# EAGLE design Nixie_clock (EAGLE 7.4.0)
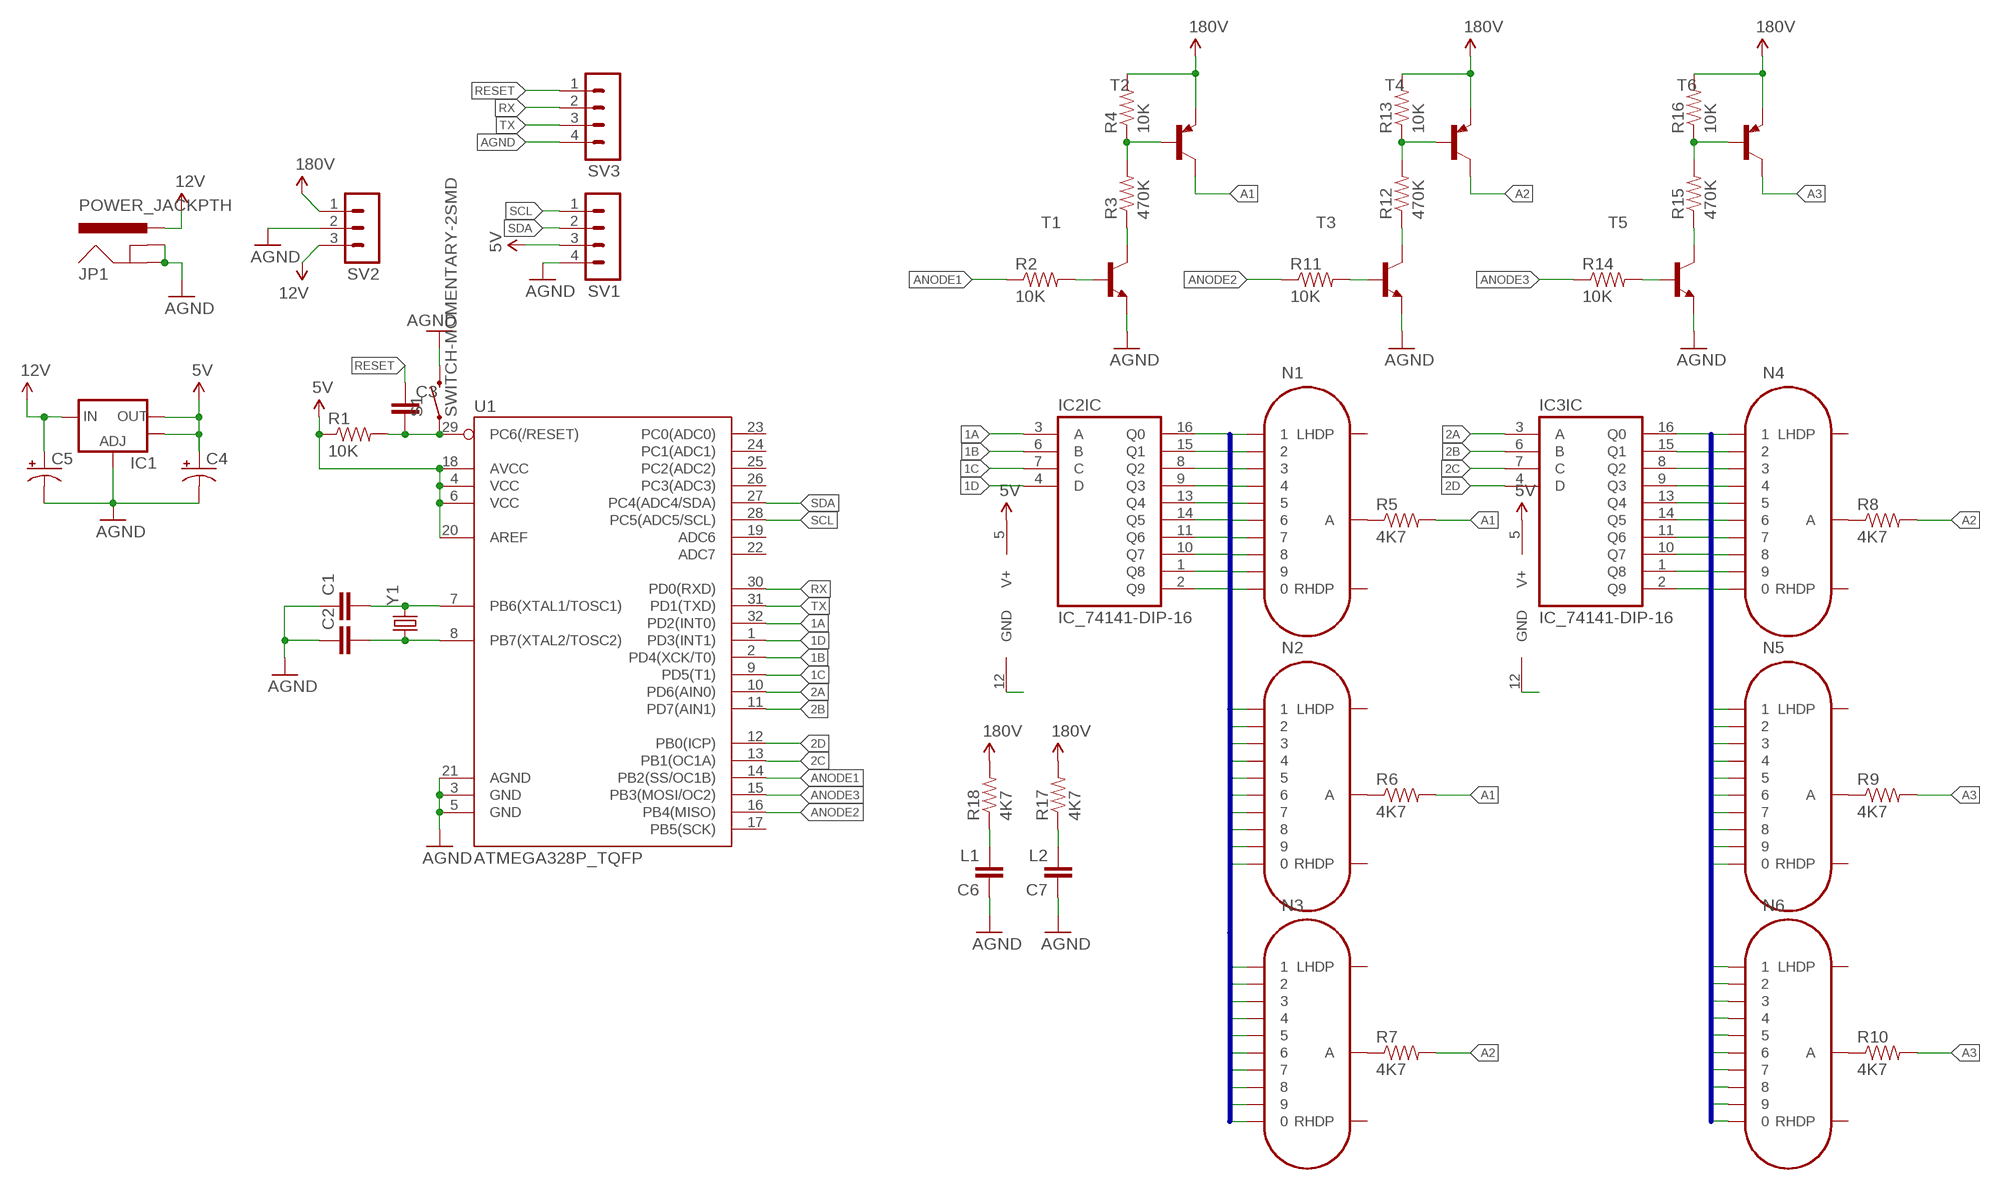
[diagram p0: schematic, sheet 1]

## Parts
C1  CAPPTH  [CAP-PTH-SMALL]
C2  CAPPTH  [CAP-PTH-SMALL]
C3  CAPPTH  [CAP-PTH-SMALL]
C4  10UF-25V-20%(PTH)  [CPOL-RADIAL-10UF-25V]
C5  10UF-25V-20%(PTH)  [CPOL-RADIAL-10UF-25V]
C6  L1  CAPPTH  [CAP-PTH-SMALL]
C7  L2  CAPPTH  [CAP-PTH-SMALL]
IC1  V_REG_LM1117SOT223  [SOT223]
IC2  IC_74141-DIP-16  [DIL16]
IC3  IC_74141-DIP-16  [DIL16]
JP1  POWER_JACKPTH  [POWER_JACK_PTH]
N1  IN-14  [IN-14]
N2  IN-14  [IN-14]
N3  IN-14  [IN-14]
N4  IN-14  [IN-14]
N5  IN-14  [IN-14]
N6  IN-14  [IN-14]
R1  10K  10KOHM-1/10W-1%(0603)0603  [0603-RES]
R2  10K  10KOHM-1/10W-1%(0603)0603  [0603-RES]
R3  470K  1KOHM-1/4W-1%(PTH)  [AXIAL-0.3]
R4  10K  1KOHM-1/4W-1%(PTH)  [AXIAL-0.3]
R5  4K7  1KOHM-1/4W-1%(PTH)  [AXIAL-0.3]
R6  4K7  1KOHM-1/4W-1%(PTH)  [AXIAL-0.3]
R7  4K7  1KOHM-1/4W-1%(PTH)  [AXIAL-0.3]
R8  4K7  1KOHM-1/4W-1%(PTH)  [AXIAL-0.3]
R9  4K7  1KOHM-1/4W-1%(PTH)  [AXIAL-0.3]
R10  4K7  1KOHM-1/4W-1%(PTH)  [AXIAL-0.3]
R11  10K  10KOHM-1/10W-1%(0603)0603  [0603-RES]
R12  470K  1KOHM-1/4W-1%(PTH)  [AXIAL-0.3]
R13  10K  1KOHM-1/4W-1%(PTH)  [AXIAL-0.3]
R14  10K  10KOHM-1/10W-1%(0603)0603  [0603-RES]
R15  470K  1KOHM-1/4W-1%(PTH)  [AXIAL-0.3]
R16  10K  1KOHM-1/4W-1%(PTH)  [AXIAL-0.3]
R17  4K7  1KOHM-1/4W-1%(PTH)  [AXIAL-0.3]
R18  4K7  1KOHM-1/4W-1%(PTH)  [AXIAL-0.3]
S1  SWITCH-MOMENTARY-2SMD  [TACTILE-SWITCH-SMD]
SV1  MA04-1  [MA04-1]
SV2  MA03-1  [MA03-1]
SV3  MA04-1  [MA04-1]
T1  MPSA42-NPN-TO92-EBC  [TO92-EBC]
T2  MPSA92-PNP-TO92-EBC  [TO92-EBC]
T3  MPSA42-NPN-TO92-EBC  [TO92-EBC]
T4  MPSA92-PNP-TO92-EBC  [TO92-EBC]
T5  MPSA42-NPN-TO92-EBC  [TO92-EBC]
T6  MPSA92-PNP-TO92-EBC  [TO92-EBC]
U1  ATMEGA328P_TQFP  [TQFP32-08]
Y1  CRYSTALHC49US  [HC49US]

## Nets
1.0V: R4.P$2 R13.P$2 R16.P$2 R17.P$2 R18.P$2 SV2.1 T2.E T4.E T6.E ; supply symbol labelled 180V
1A: IC2.3(IC:A) U1.32(PD2(INT0))
1B: IC2.6(IC:B) U1.2(PD4(XCK/T0))
1C: IC2.7(IC:C) U1.9(PD5(T1))
1D: IC2.4(IC:D) U1.1(PD3(INT1))
2A: IC3.3(IC:A) U1.10(PD6(AIN0))
2B: IC3.6(IC:B) U1.11(PD7(AIN1))
2C: IC3.7(IC:C) U1.13(PB1(OC1A))
2D: IC3.4(IC:D) U1.12(PB0(ICP))
5V: C4.1(+) IC1.2(OUT) IC1.4(OUT) IC2.5(SUPPLY:V+) IC3.5(SUPPLY:V+) R1.1 SV1.3 U1.4(VCC) U1.6(VCC) U1.18(AVCC) U1.20(AREF)
12V: C5.1(+) IC1.3(IN) JP1.PWR SV2.3
A1: R5.P$2 R6.P$2 T2.C
A2: R7.P$2 R8.P$2 T4.C
A3: R9.P$2 R10.P$2 T6.C
AGND: C1.1 C2.1 C4.2(-) C5.2(-) C6.1 C7.1 IC1.1(ADJ) IC2.12(SUPPLY:GND) IC3.12(SUPPLY:GND) JP1.GND JP1.GNDBREAK S1.3 SV1.4 SV2.2 SV3.4 T1.E T3.E T5.E U1.3(GND) U1.5(GND) U1.21(AGND)
ANODE1: R2.1 U1.14(PB2(SS/OC1B))
ANODE2: R11.1 U1.16(PB4(MISO))
ANODE3: R14.1 U1.15(PB3(MOSI/OC2))
N$1: C1.2 U1.7(PB6(XTAL1/TOSC1)) Y1.2
N$2: C2.2 U1.8(PB7(XTAL2/TOSC2)) Y1.1
N$3: C3.2 R1.2 S1.1 U1.29(PC6(/RESET))
N$4: R2.2 T1.B
N$5: R3.P$1 T1.C
N$6: R3.P$2 R4.P$1 T2.B
N$7: N1.A R5.P$1
N$8: N2.A R6.P$1
N$9: N3.A R7.P$1
N$10: N4.A R8.P$1
N$11: N5.A R9.P$1
N$12: N6.A R10.P$1
N$13: R11.2 T3.B
N$14: R12.P$1 T3.C
N$15: R12.P$2 R13.P$1 T4.B
N$16: R14.2 T5.B
N$17: R15.P$1 T5.C
N$18: R15.P$2 R16.P$1 T6.B
N$19: C6.2 R18.P$1
N$20: C7.2 R17.P$1
NIXIE0: IC2.16(IC:Q0) N1.0 N2.0 N3.0
NIXIE1: IC2.15(IC:Q1) N1.1 N2.1 N3.1
NIXIE2: IC2.8(IC:Q2) N1.2 N2.2 N3.2
NIXIE3: IC2.9(IC:Q3) N1.3 N2.3 N3.3
NIXIE4: IC2.13(IC:Q4) N1.4 N2.4 N3.4
NIXIE5: IC2.14(IC:Q5) N1.5 N2.5 N3.5
NIXIE6: IC2.11(IC:Q6) N1.6 N2.6 N3.6
NIXIE7: IC2.10(IC:Q7) N1.7 N2.7 N3.7
NIXIE8: IC2.1(IC:Q8) N1.8 N2.8 N3.8
NIXIE9: IC2.2(IC:Q9) N1.9 N2.9 N3.9
NIXIEB0: IC3.16(IC:Q0) N4.0 N5.0 N6.0
NIXIEB1: IC3.15(IC:Q1) N4.1 N5.1 N6.1
NIXIEB2: IC3.8(IC:Q2) N4.2 N5.2 N6.2
NIXIEB3: IC3.9(IC:Q3) N4.3 N5.3 N6.3
NIXIEB4: IC3.13(IC:Q4) N4.4 N5.4 N6.4
NIXIEB5: IC3.14(IC:Q5) N4.5 N5.5 N6.5
NIXIEB6: IC3.11(IC:Q6) N4.6 N5.6 N6.6
NIXIEB7: IC3.10(IC:Q7) N4.7 N5.7 N6.7
NIXIEB8: IC3.1(IC:Q8) N4.8 N5.8 N6.8
NIXIEB9: IC3.2(IC:Q9) N4.9 N5.9 N6.9
RESET: C3.1 SV3.1
RX: SV3.2 U1.30(PD0(RXD))
SCL: SV1.1 U1.28(PC5(ADC5/SCL))
SDA: SV1.2 U1.27(PC4(ADC4/SDA))
TX: SV3.3 U1.31(PD1(TXD))
Unconnected: N1.LHDP N1.RHDP N2.LHDP N2.RHDP N3.LHDP N3.RHDP N4.LHDP N4.RHDP N5.LHDP N5.RHDP N6.LHDP N6.RHDP U1.17(PB5(SCK)) U1.19(ADC6) U1.22(ADC7) U1.23(PC0(ADC0)) U1.24(PC1(ADC1)) U1.25(PC2(ADC2)) U1.26(PC3(ADC3))

## Buses
NIXIE[0..9]
NIXIEB[0..9]

## Library data of the parts
C1-C3 C6 C7 = SparkFun-Capacitors:CAP: Capacitor Standard 0603 ceramic capacitor, and 0.1" leaded capacitor.
C4 C5 = SparkFun-Capacitors:10UF-25V-20%(PTH): CAP-08440; PROD_ID: CAP-08440
IC1 = SparkFun-PowerIC:V_REG_LM1117: Voltage Regulator LM1117 Standard adjustable voltage regulator but in SMD form. Spark Fun Electronics SKU : COM-00595; PROD_ID: VREG-08170
IC2 IC3 = dp_devices:IC_74141: BCD to decimal decoder
JP1 = SparkFun-Connectors:POWER_JACK: Power Jack This is the standard 5.5mm barrel jack for power. The PTH is the most common, proven, reliable, footprint. The Slot footprint only works if the mill layer is transmitted to the PCB fab house so be warned. Mating wall wart : TOL-00298 (and others); PROD_ID: CONN-08197
N1-N6 = russian-nixies:IN-14: IN-14: medium numeric frontview nixie tube
R1 R2 R11 R14 = SparkFun-Resistors:10KOHM-1/10W-1%(0603): RES-00824; PROD_ID: RES-00824
R3-R10 R12 R13 R15-R18 = SparkFun-Resistors:1KOHM-1/4W-1%(PTH): RES-12182; PROD_ID: RES-12182; VALUE: 1K
S1 = SparkFun-Electromechanical:SWITCH-MOMENTARY-2: Various NO switches- pushbuttons, reed, etc; PROD_ID: SWCH-08247
SV1 SV3 = con-lstb:MA04-1: PIN HEADER; OC_FARNELL: unknown; OC_NEWARK: unknown
SV2 = con-lstb:MA03-1: PIN HEADER; OC_FARNELL: unknown; OC_NEWARK: unknown
T1 T3 T5 = transistor:*-NPN-: NPN Transistror BF959 corrected 2008.03.06
T2 T4 T6 = transistor:*-PNP-: PNP Transistror
U1 = SparkFun-DigitalIC:ATMEGA328P_TQFP; PROD_ID: IC-09069
Y1 = SparkFun-FreqCtrl:CRYSTAL: Various standard crystals. Proven footprints.

## Board
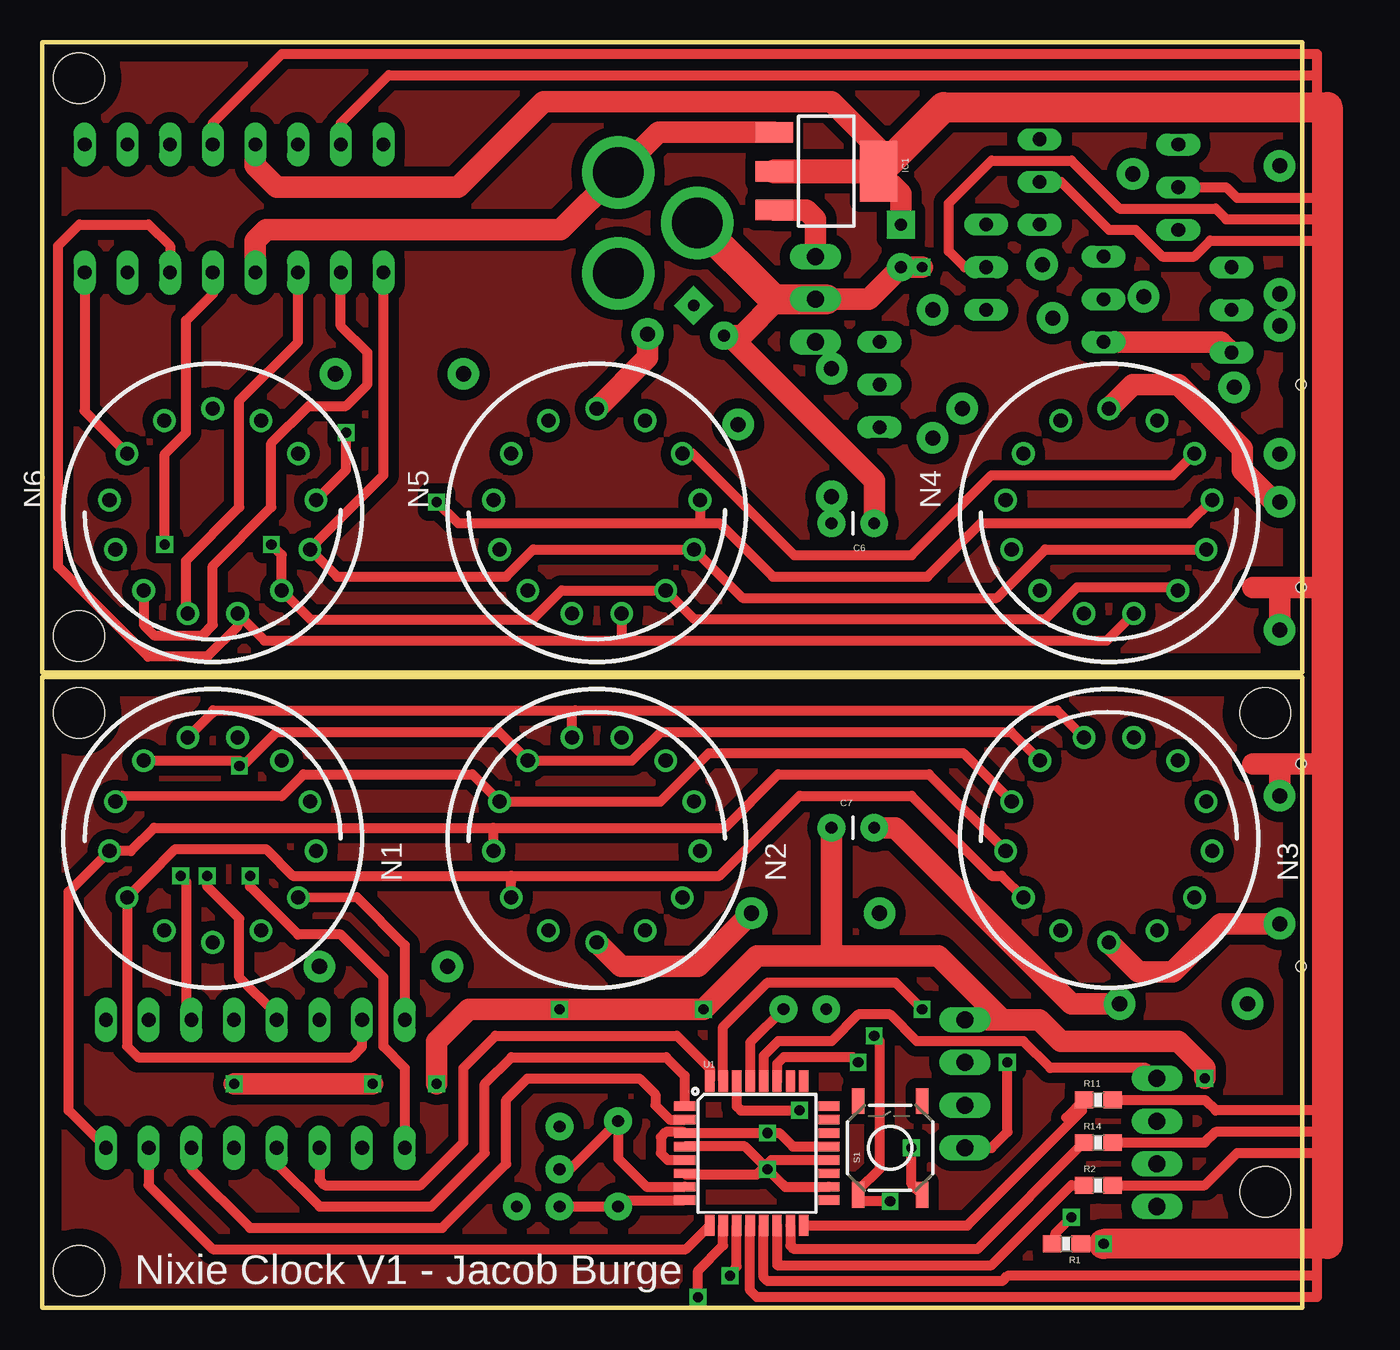
[diagram p1: board, top side]
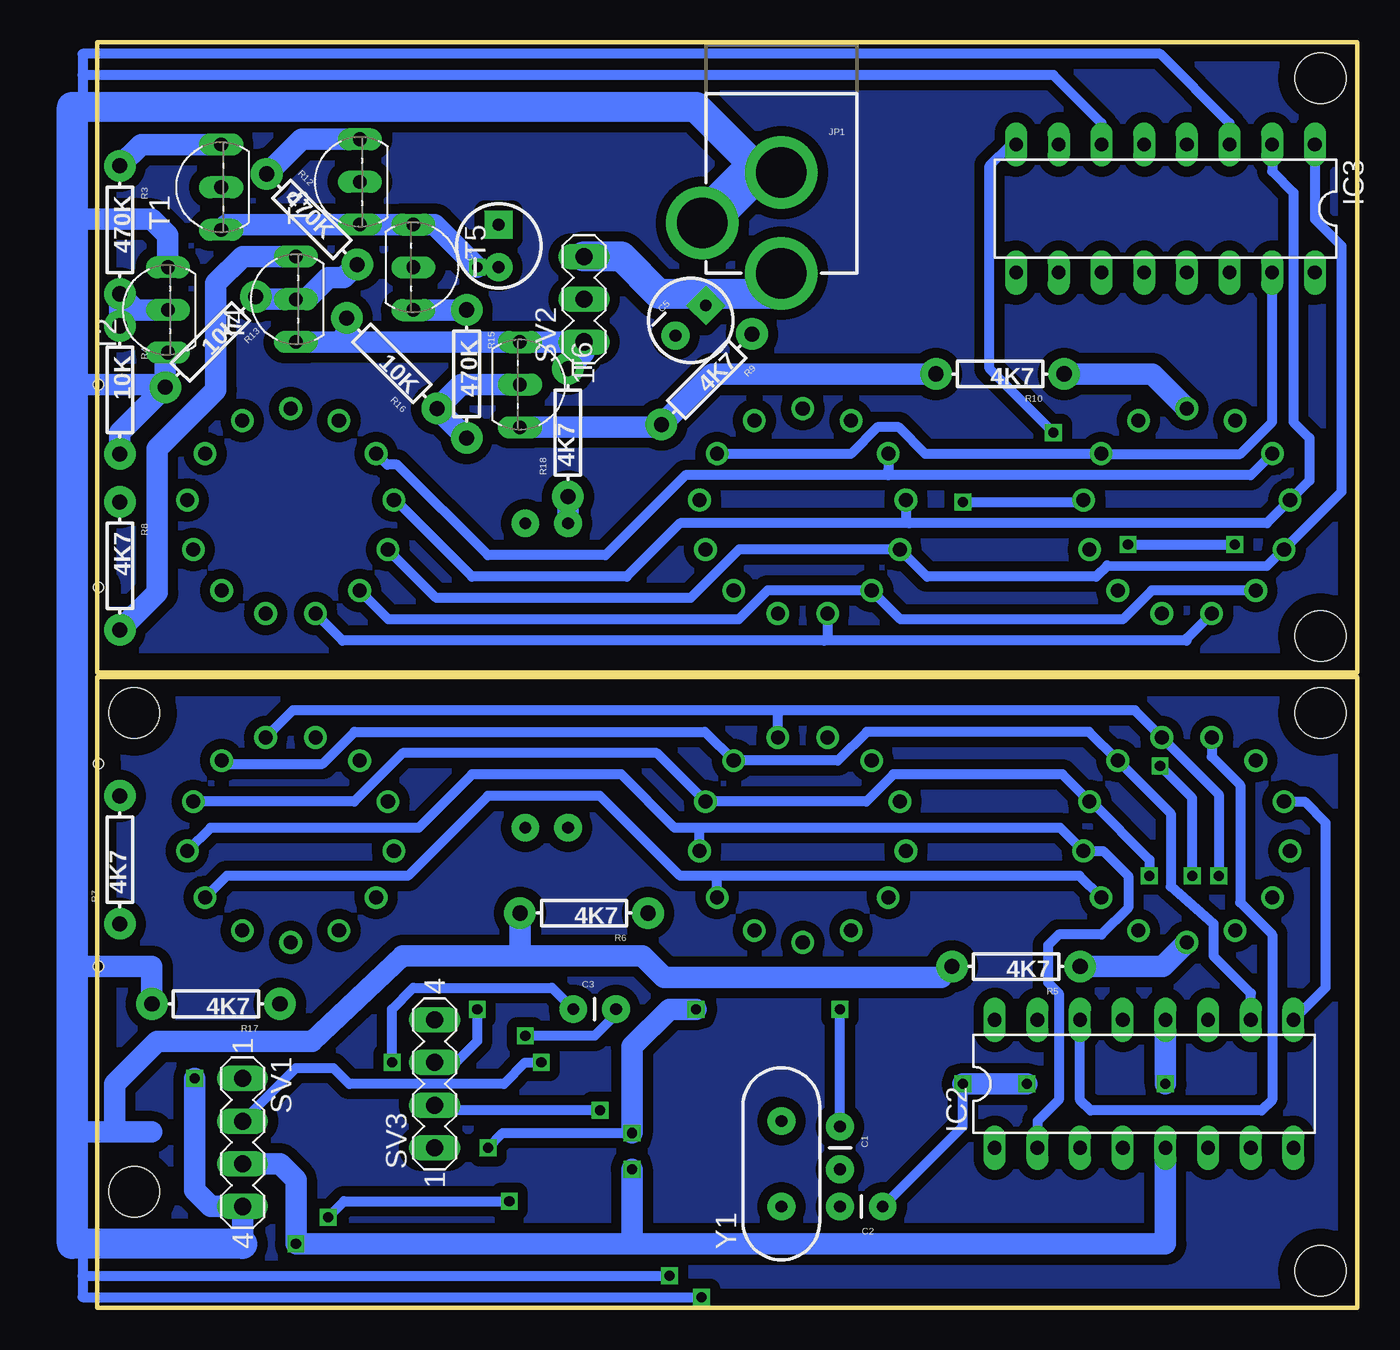
[diagram p2: board, bottom side, seen from below]

Size 75 x 75.34 mm. Coordinates in mm from the lower left corner, seen from the top.
Outline: 0,0 75,0 75,37.54 0,37.54 0,0
Outline: 0,37.8 0,75.34 75,75.34 75,37.8 0,37.8
Copper layers (1*16): Top 0.035mm / dielectric 1.5mm / Bottom 0.035mm
Design rules "default": minimum track width 10mil, minimum drill 24mil, track to track 8mil, track to pad 8mil, pad to pad 8mil, via to via 8mil, smd to smd 8mil, copper to edge 40mil, drill to drill 8mil, minimum pad ring 10mil, minimum via ring 8mil, stop-mask expansion 4mil, vias tented up to drill 0mil, thermal gap 10mil
Holes 0.6 mm at 74.93,32.38 74.93,42.89 74.93,20.32 74.93,54.95
Holes 3 mm at 2.2,35.4 2.2,40 2.2,73.2 2.2,2.2 72.8,35.4 72.8,6.9

### Footprints (pad centres in the part's own frame; a part is rotated, then mirrored left to right if it is on the bottom)
CAP-PTH-SMALL = drill 0.7 pad 1.651: 1 0,0; 2 2.54,0
CPOL-RADIAL-10UF-25V = drill 0.7 pad 1.651 square: 1 1.27,0 | drill 0.7 pad 1.651: 2 -1.27,0
SOT223 = smd 1.219 x 2.235: 1 -2.311,-3.099; 2 0,-3.099; 3 2.311,-3.099 | smd 3.6 x 2.2: 4 0,3.099
DIL16 = drill 0.813 long: 1 -8.89,-3.81; 2 -6.35,-3.81; 3 -3.81,-3.81; 4 -1.27,-3.81; 5 1.27,-3.81; 6 3.81,-3.81; 7 6.35,-3.81; 8 8.89,-3.81; 9 8.89,3.81; 10 6.35,3.81; 11 3.81,3.81; 12 1.27,3.81; 13 -1.27,3.81; 14 -3.81,3.81; 15 -6.35,3.81; 16 -8.89,3.81
POWER_JACK_PTH = drill 2.997 pad 4.318: GND 0,7.7; GNDBREAK 4.7,10.7; PWR 0,13.7
IN-14 = drill 0.84: 0 5.094,-3.516; 1 -5.094,-3.516; 2 -6.145,-0.746; 3 -5.788,2.195; 4 -4.105,4.633; 5 -1.481,6.01; 6 1.481,6.01; 7 4.105,4.633; 8 5.788,2.195; 9 6.145,-0.746; A 0,-6.19; LHDP 2.877,-5.481; RHDP -2.877,-5.481
0603-RES = smd 1.1 x 1: 1 -0.85,0; 2 0.85,0
AXIAL-0.3 = drill 0.9 pad 1.88: P$1 -3.81,0; P$2 3.81,0
TACTILE-SWITCH-SMD = smd 1.524 x 0.762: 1 -2.794,1.905; 2 2.794,1.905; 3 -2.794,-1.905; 4 2.794,-1.905
MA04-1 = drill 1.016 long: 1 -3.81,0; 2 -1.27,0; 3 1.27,0; 4 3.81,0
MA03-1 = drill 1.016 long: 1 -2.54,0; 2 0,0; 3 2.54,0
TO92-EBC = drill 0.813 long: B 0,-1.27; C 2.54,-1.27; E -2.54,-1.27
TQFP32-08 = smd 1.27 x 0.559: 1 -4.293,2.8; 2 -4.293,2; 3 -4.293,1.2; 4 -4.293,0.4; 5 -4.293,-0.4; 6 -4.293,-1.2; 7 -4.293,-2; 8 -4.293,-2.8; 17 4.293,-2.8; 18 4.293,-2; 19 4.293,-1.2; 20 4.293,-0.4; 21 4.293,0.4; 22 4.293,1.2; 23 4.293,2; 24 4.293,2.8 | smd 0.559 x 1.27: 9 -2.8,-4.293; 10 -2,-4.293; 11 -1.2,-4.293; 12 -0.4,-4.293; 13 0.4,-4.293; 14 1.2,-4.293; 15 2,-4.293; 16 2.8,-4.293; 25 2.8,4.293; 26 2,4.293; 27 1.2,4.293; 28 0.4,4.293; 29 -0.4,4.293; 30 -1.2,4.293; 31 -2,4.293; 32 -2.8,4.293
HC49US = drill 0.7 pad 1.651: 1 -2.54,0; 2 2.54,0

### Placement (x,y rotation side)
C1  30.8,10.79 270 bottom
C2  28.26,6.03 180 bottom
C3  46.67,17.78 0 bottom
C4  51.12,63.21 90 bottom
C5  39.69,58.77 45 bottom
C6  49.53,46.7 180 top
C7  46.99,28.57 0 top
IC1  46.67,67.66 270 top
IC2  12.7,13.34 0 bottom
IC3  11.43,65.43 180 bottom
JP1  34.29,75.28 180 bottom
N1  10.16,27.94 0 top
N2  33.02,27.94 0 top
N3  63.5,27.94 0 top
N4  63.5,47.34 180 top
N5  33.02,47.34 180 top
N6  10.16,47.34 180 top
R1  60.96,3.81 180 top
R2  62.87,7.3 0 top
R3  73.66,64.16 270 bottom
R4  73.66,54.64 270 bottom
R5  20.32,20.32 180 bottom
R6  46.04,23.5 180 bottom
R7  73.66,26.67 90 bottom
R8  73.66,44.16 270 bottom
R9  38.73,55.27 225 bottom
R10  21.27,55.59 180 bottom
R11  62.87,12.38 0 top
R12  62.23,64.8 315 bottom
R13  68.26,57.49 225 bottom
R14  62.87,9.84 0 top
R15  53.02,55.59 270 bottom
R16  57.47,56.23 135 bottom
R17  67.94,18.1 180 bottom
R18  46.99,52.1 90 bottom
S1  50.48,9.53 90 top
SV1  66.36,9.84 270 bottom
SV2  46.04,60.03 90 bottom
SV3  54.93,13.34 90 bottom
T1  68.9,66.7 90 bottom
T2  72.07,59.4 90 bottom
T3  60.64,67.02 90 bottom
T4  64.45,60.03 90 bottom
T5  54.93,61.94 270 bottom
T6  48.58,54.95 270 bottom
U1  42.55,9.21 0 top
Y1  34.29,8.57 90 bottom

### Tracks (layer width: path | path; a pad name or v marks a point on that pad's centre or on a via)
1.0V
  Top 1.27: T2.E 70.17,57.49 T4.E
  Bottom 1.27: 60.64,57.49 T6.E SV2.1 46.04,56.86 R18.P$2 | 60.16,57.98 60.64,57.49 | R16.P$2 60.16,57.98 | 60.16,57.98 | R4.P$2 73.66,52.1 R13.P$2 | 60.64,57.49 T4.E | T2.E 70.96,56.71 R13.P$2 | R13.P$2 71.11,54.95 76.52,54.95 76.52,20.32 71.75,20.32 R17.P$2
1A
  Top 0.61: IC2.3 16.51,7.62 16.83,7.3 22.54,7.3 25.08,9.84 25.08,14.29 26.99,16.19 37.78,16.19 39.74,14.23 U1.32
1B
  Top 0.61: IC2.6 8.89,8.26 12.38,4.76 23.81,4.76 27.62,8.57 27.62,12.38 28.89,13.65 35.56,13.65 36.51,12.7 36.51,12.06 37.37,11.21 U1.2
1C
  Top 0.61: IC2.7 6.35,7.3 10.16,3.49 38.32,3.49 U1.9
1D
  Top 0.61: IC2.4 13.97,8.57 16.51,6.03 23.18,6.03 26.35,9.21 26.35,13.34 27.94,14.92 37.15,14.92 38.25,13.82 U1.1
2A  (via drill 0.6)
  Top 0.61: v39.05,0.64 39.05,2.22 40.55,3.71 U1.10
  Bottom 0.61: IC3.3 7.62,70.51 11.75,74.64 75.88,74.64 75.88,0.64 v39.05,0.64
2B  (via drill 0.6)
  Top 0.61: v40.96,1.91 41.34,2.47 U1.11
  Bottom 0.61: IC3.6 15.24,70.51 18.1,73.37 75.88,73.37 75.88,1.91 v40.96,1.91
2C
  Top 0.61: IC3.7 17.78,70.51 20.64,73.37 75.88,73.37 75.88,1.91 57.47,1.91 57.15,1.59 43.18,1.59 42.95,1.82 U1.13
2D
  Top 0.61: IC3.4 10.16,70.51 14.29,74.64 75.88,74.64 75.88,0.64 42.55,0.64 42.15,1.03 U1.12
5V  (via drill 0.6)
  Top 0.61: U1.6 38.32,7.94 42.55,7.94 43.02,8.41 | 43.02,8.41 43.41,8.81 U1.20 | 43.02,8.41 41.83,9.61 U1.4 | 43.02,8.41 v43.18,8.26 44.13,7.3 44.24,7.2 U1.18 | R1.1 v63.18,3.81
  Top 1.27: C4.1 51.12,66.31 49.85,67.58 | 49.85,67.58 IC1.4 49.77,69 46.99,71.78 29.84,71.78 24.77,66.7 13.97,66.7 12.7,67.97 IC3.5 | 49.85,67.58 49.85,67.66
  Top 1.422: IC1.2 IC1.4
  Top 1.778: 49.85,67.66 53.66,71.47 76.52,71.47 76.52,3.81 v63.18,3.81
  Bottom 1.27: 43.18,3.81 v63.18,3.81 63.18,7.62 64.14,8.57 SV1.3 | 43.18,3.81 11.43,3.81 IC2.5 | v43.18,8.26 43.18,3.81
12V
  Top 1.27: IC1.3 45.49,65.34 46.04,64.8 SV2.3
  Bottom 1.27: C5.1 38.79,60.3 38.73,60.35
  Bottom 1.778: JP1.PWR 34.29,60.99 34.92,60.35 38.73,60.35 41.59,60.35 43.81,62.58 SV2.3
A1
  Bottom 1.27: R5.P$2 24.77,19.68 41.27,19.68 42.55,20.95 49.85,20.95 | 49.85,20.95 56.83,20.95 62.23,15.88 71.44,15.88 73.98,13.34 73.98,10.48 | R6.P$2 49.85,20.95 | T2.C 70.8,63.84 71.75,64.8 76.2,64.8 76.2,10.48 73.98,10.48 | 71.75,10.48 73.98,10.48
A2
  Top 1.27: R8.P$2 73.66,42.89 | 73.66,42.89 72.07,42.89 | 73.66,42.89 76.2,42.89 76.2,32.38 73.66,32.38 | 72.07,32.38 73.66,32.38 | 73.66,32.38 R7.P$2
  Bottom 1.27: R8.P$2 71.44,42.57 71.44,51.15 67.94,54.64 67.94,60.99 66.36,62.58 T4.C
A3
  Bottom 1.27: R10.P$2 38.42,55.59 R9.P$2 41.59,52.41 T6.C
AGND  (via drill 0.6)
  Top 0.61: U1.21 44.69,9.61 43.88,10.41 v43.18,10.41 U1.3 38.18,10.48 37.15,10.48 36.83,10.16 36.83,9.21 37.23,8.81 U1.5 | S1.3 51.75,7.37 v51.75,9.53
  Top 1.27: SV2.2 46.67,60.03 49.21,60.03 C4.2 v52.39,61.94 | IC1.1 36.68,69.97 JP1.GND 30.88,64.16 13.34,64.16 12.7,63.53 IC3.12 | 40.9,57.87 41.65,57.87 43.81,60.03 | C6.1 49.53,49.24 40.9,57.87 | 40.9,57.87 C5.2 | v69.22,13.65 69.22,14.29 67.63,15.88 60.64,15.88 59.37,17.14 57.15,17.14 | 57.15,17.14 SV3.4 | C7.1 46.99,20.95 | 46.99,20.95 53.34,20.95 57.15,17.14 | 46.99,20.95 42.55,20.95 v39.37,17.78 v30.8,17.78 25.4,17.78 23.5,15.88 v23.5,13.34 | v19.68,13.34 v11.43,13.34
  Top 1.778: JP1.GNDBREAK 43.53,60.03 43.81,60.03 46.67,60.03
  Bottom 0.61: C1.1 v30.8,17.78 | C2.1 23.5,10.79 v23.5,13.34 | v51.75,9.53 50.87,10.41 v43.18,10.41
  Bottom 1.27: v52.39,61.94 54.93,64.48 T5.E T3.E 67.31,64.48 T1.E | 66.36,3.81 SV1.4 68.26,6.03 69.22,6.99 v69.22,13.65 | v23.5,13.34 v19.68,13.34 | v11.43,13.34 IC2.12 | v39.37,17.78 40.96,17.78 43.18,15.56 v43.18,10.41
  Bottom 1.778: 66.36,3.81 76.52,3.81 76.52,71.47 39.37,71.47 35.48,67.58 JP1.GND
  Bottom 2.54: JP1.GNDBREAK 35.99,67.58 JP1.GND
ANODE1
  Top 0.61: U1.14 43.74,2.54 56.52,2.54 61.28,7.3 R2.1
ANODE2
  Top 0.61: U1.16 55.08,4.92 61.91,11.75 60.96,11.33 R11.1
ANODE3
  Top 0.61: U1.15 44.55,3.71 44.77,3.49 55.66,3.49 R14.1
N$1
  Top 0.61: U1.7 35.97,7.21 34.29,8.89 Y1.2 31.43,8.26 C1.2
N$2
  Top 0.61: U1.8 34.66,6.41 Y1.1 C2.2
N$3  (via drill 0.6)
  Top 0.61: C3.2 42.15,15.79 U1.29 | v49.53,16.19 49.85,15.88 49.85,8.26 48.58,6.99 S1.1 48.58,6.35 v50.48,6.35 | R1.2 60.33,4.03 60.33,4.45 v61.28,5.4
  Bottom 0.61: C3.2 44.13,17.46 45.4,16.19 v49.53,16.19 | v61.28,5.4 60.33,6.35 v50.48,6.35
N$4
  Top 0.61: T1.B 70.48,66.7 71.12,66.07 76.2,66.07 76.2,9.21 71.12,9.21 69.22,7.3 R2.2
N$5
  Bottom 1.27: T1.C 72.39,69.24 R3.P$1
N$6
  Bottom 1.27: R4.P$1 R3.P$2 72.71,59.4 T2.B
N$7
  Bottom 1.27: N1.A 11.59,20.32 R5.P$1
N$8
  Top 1.27: N2.A 34.45,20.32 39.05,20.32 R6.P$1
N$9
  Top 1.27: R7.P$1 70.17,22.86 67.31,20 65.25,20 N3.A
N$10
  Top 1.27: N4.A 64.93,54.95 67.63,54.95 71.44,51.15 71.44,49.88 73.34,47.97 R8.P$1
N$11
  Top 1.27: N5.A 36.04,56.55 R9.P$1
N$12
  Bottom 1.27: N6.A 12.22,55.59 R10.P$1
N$13
  Top 0.61: T3.B 60.64,67.02 63.5,64.16 65.09,64.16 66.67,62.58 68.58,62.58 69.53,63.53 76.2,63.53 76.2,11.75 69.85,11.75 69.22,12.38 R11.2
N$14
  Bottom 1.27: R12.P$1 62.86,69.56 T3.C
N$15
  Bottom 1.27: R13.P$1 65.41,60.03 T4.B 62.55,60.03 61.28,61.3 60.33,61.3 R12.P$2
N$16
  Top 0.61: 57.15,61.94 T5.B 54.93,61.94 53.98,62.89 53.98,65.75 56.52,68.29 61.28,68.29 64.14,65.43 69.85,65.43 70.48,64.8 76.2,64.8 76.2,10.48 69.85,10.48 69.22,9.84 R14.2
N$17
  Bottom 1.27: R15.P$1 T5.C
N$18
  Bottom 1.27: T6.B 53.35,54.95 R16.P$1 R15.P$2
N$19
  Bottom 1.27: R18.P$1 C6.2
N$20
  Top 1.27: R17.P$1 61.28,18.1 50.8,28.57 C7.2
N$21
  pour Bottom (isolate 0.61): -0.32,75.91 75.25,75.91 75.25,0 -0.32,0
N$22
  pour Top (isolate 0.61): -0.32,75.91 75.25,75.91 75.25,0 -0.32,0
NIXIE0
  Top 0.61: N1.0 18.73,24.45 21.59,21.59 IC2.16
  Bottom 0.61: N1.0 16.55,25.72 38.1,25.72 | 38.1,25.72 40.32,25.72 45.09,30.48 51.75,30.48 56.52,25.72 67.3,25.72 N3.0 | N2.0 38.11,25.7 38.1,25.72
NIXIE1
  Top 0.61: 27.94,25.72 14.92,25.72 13.34,27.3 7.94,27.3 6.36,25.72 N1.1 5.07,15.57 5.71,14.92 18.41,14.92 19.05,15.56 IC2.15 | 27.94,25.72 40.32,25.72 45.09,30.48 51.75,30.48 56.52,25.72 57.11,25.72 N3.1 | N2.1 27.93,25.39 27.94,25.72
NIXIE2
  Top 0.61: 26.88,28.57 6.67,28.57 5.29,27.19 N1.2 1.59,24.77 1.59,11.75 IC2.8 | 26.88,28.57 40.64,28.57 43.81,31.75 52.8,31.75 N3.2 | N2.2 26.88,28.57
NIXIE3
  Top 0.61: N3.3 54.83,33.02 39.69,33.02 36.8,30.14 N2.3 25.62,31.75 15.56,31.75 14.26,30.45 4.76,30.48 4.42,30.14 N1.3
  Bottom 0.61: N1.3 3.15,30.14 1.91,28.89 1.91,19.05 IC2.9
NIXIE4  (via drill 0.6)
  Top 0.61: N1.4 11.75,32.57 v11.75,32.26 11.94,32.26 13.97,34.29 27.2,34.29 N2.4 35.11,32.57 36.83,34.29 57.68,34.29 N3.4 | IC2.13 13.97,17.46 11.75,19.68 11.75,23.18 9.84,25.08 v9.84,25.72
  Bottom 0.61: v9.84,25.72 9.84,30.35 v11.75,32.26
NIXIE5
  Top 0.61: N1.5 10.16,35.43 10.16,35.56 31.75,35.56 | 31.75,35.56 60.41,35.56 N3.5 | N2.5 31.54,35.35 31.75,35.56
  Bottom 0.61: N1.5 8.68,32.81 6.99,31.11 6.99,24.13 5.08,22.23 5.08,12.38 5.71,11.75 15.88,11.75 16.51,12.38 IC2.14
NIXIE6  (via drill 0.6)
  Top 0.61: v8.26,25.72 8.57,25.4 8.57,17.46 IC2.11
  Bottom 0.61: 34.29,35.56 13.25,35.56 N1.6 8.26,30.56 v8.26,25.72 | 34.29,35.56 63.37,35.56 N3.6 | N2.6 34.5,35.35 34.29,35.56
NIXIE7
  Bottom 0.61: N3.7 67.42,32.38 61.59,32.38 59.69,34.29 38.84,34.29 N2.7 30.93,32.57 29.21,34.29 15.98,34.29 N1.7 11.11,29.42 11.11,25.08 8.57,22.86 8.57,20.95 6.35,18.73 IC2.10
NIXIE8  (via drill 0.6)
  Top 0.61: v12.38,25.72 12.38,25.08 15.24,22.23 17.78,22.23 20.32,19.68 20.32,15.56 21.59,14.29 IC2.1
  Bottom 0.61: N3.8 59.72,30.14 56.83,33.02 41.69,33.02 N2.8 29.24,30.14 27.62,31.75 17.56,31.75 N1.8 15.85,30.14 12.38,26.67 v12.38,25.72
NIXIE9
  Bottom 0.61: 39.37,28.57 17.69,28.57 N1.9 15.13,27.19 13.65,25.72 13.65,23.81 15.24,22.23 17.78,22.23 18.41,21.59 18.41,19.37 17.78,18.73 17.78,12.38 19.05,11.11 IC2.2 | 39.37,28.57 40.64,28.57 43.81,31.75 52.7,31.75 55.88,28.57 68.26,28.57 N3.9 | N2.9 39.16,28.37 39.37,28.57
NIXIEB0
  Top 0.61: IC3.16 2.54,53.38 N6.0
  Bottom 0.61: N6.0 6.36,49.56 27.94,49.56 | 27.94,49.56 40.01,49.56 44.77,44.8 51.75,44.8 57.15,50.19 57.75,50.19 N4.0 | N5.0 27.93,49.89 27.94,49.56
NIXIEB1
  Top 0.61: N4.1 67.3,49.56 56.52,49.56 51.75,44.8 44.77,44.8 38.71,50.85 N5.1
  Bottom 0.61: IC3.15 5.08,52.73 6.99,50.83 15.23,50.83 N6.1 15.28,50.83 25.72,50.83 27.3,52.41 28.57,52.41 30.16,50.83 38.09,50.83 N5.1
NIXIEB2  (via drill 0.6)
  Top 0.61: 39.05,46.7 24.77,46.7 v23.5,47.97 | 39.05,46.7 40.32,46.7 43.5,43.52 52.7,43.52 55.88,46.7 68.26,46.7 N4.2 | N5.2 39.16,46.81 39.05,46.7 | N6.2 18.1,49.87 v18.1,52.1
  Bottom 0.61: v23.5,47.97 16.42,47.97 N6.2 | v18.1,52.1 21.91,55.91 21.91,67.97 20.64,69.24 IC3.8
NIXIEB3
  Top 0.61: N4.3 59.72,45.14 56.83,42.26 41.69,42.26 N5.3 29.24,45.14 27.62,43.52 17.56,43.52 N6.3 15.95,45.19 20.32,49.56 IC3.9
NIXIEB4  (via drill 0.6)
  Top 0.61: N4.4 67.42,42.89 61.59,42.89 59.69,40.98 38.84,40.98 N5.4 30.93,42.7 29.21,40.98 15.98,40.98 N6.4 14.27,44.82 v13.65,45.43 | v7.3,45.43 7.3,50.83 8.57,52.1 8.57,58.77 10.16,60.35 IC3.13
  Bottom 0.61: v13.65,45.43 v7.3,45.43
NIXIEB5
  Top 0.61: 34.29,39.72 13.25,39.72 N6.5 11.64,40.56 9.84,38.76 6.32,38.76 0.95,44.12 0.95,63.21 2.22,64.48 6.35,64.48 7.62,63.21 IC3.14 | 34.29,39.72 63.37,39.72 N4.5 | N5.5 34.5,39.93 34.29,39.72
NIXIEB6
  Top 0.61: N6.6 8.57,41.43 8.57,44.48 11.75,47.65 11.75,54 15.24,57.49 IC3.11
  Bottom 0.61: N6.6 10.16,39.84 10.16,39.72 31.75,39.72 | 31.75,39.72 60.41,39.72 N4.6 | N5.6 31.54,39.93 31.75,39.72
NIXIEB7
  Top 0.61: N6.7 6.05,40.65 6.67,40.03 9.53,40.03 10.16,40.67 10.16,44.16 13.65,47.65 13.65,51.46 15.88,53.69 18.1,53.69 19.37,54.95 19.37,56.86 17.78,58.45 IC3.10
  Bottom 0.61: N4.7 57.68,40.98 36.83,40.98 35.11,42.7 N5.7 27.2,40.98 13.97,40.98 12.25,42.7 N6.7
NIXIEB8
  Bottom 0.61: N4.8 54.83,42.26 39.69,42.26 36.8,45.14 N5.8 25.62,43.52 15.56,43.52 14.89,44.19 5.4,44.16 4.42,45.14 N6.8 0.95,48.56 0.95,63.21 2.54,64.8 IC3.1
NIXIEB9
  Bottom 0.61: 26.67,46.7 5.4,46.7 N6.9 2.86,49.24 2.86,51.78 3.81,52.73 3.81,66.39 5.08,67.66 IC3.2 | 26.67,46.7 40.32,46.7 43.5,43.52 52.7,43.52 57.26,48.08 N4.9 | N5.9 26.88,46.91 26.67,46.7
RESET  (via drill 0.6)
  Top 0.61: SV3.1 56.52,9.53 57.47,10.48 v57.47,14.61
  Bottom 0.61: v57.47,14.61 57.47,17.78 56.2,19.05 47.94,19.05 C3.1
RX  (via drill 0.6)
  Top 0.61: U1.30 41.34,11.99 41.59,11.75 v45.09,11.75
  Bottom 0.61: v45.09,11.75 54.61,11.75 SV3.2
SCL
  Top 0.61: SV1.1 65.72,14.29 60.01,14.29 58.42,15.88 52.07,15.88 50.48,17.46 48.58,17.46 46.99,15.88 43.81,15.88 42.95,15.01 U1.28
SDA  (via drill 0.6)
  Top 0.61: v48.58,14.61 48.26,14.92 44.13,14.92 43.74,14.54 U1.27
  Bottom 0.61: SV1.2 63.18,14.29 60.96,14.29 60.01,13.34 50.8,13.34 49.53,14.61 v48.58,14.61
TX  (via drill 0.6)
  Top 0.61: U1.31 40.55,16.73 43.18,19.37 50.8,19.37 v52.39,17.78
  Bottom 0.61: v52.39,17.78 52.39,15.88 53.66,14.61 SV3.3

### Text on the board
tNames: Nixie Clock V1 - Jacob Burge